# Altium project gumstix expansioan board.PrjPCB
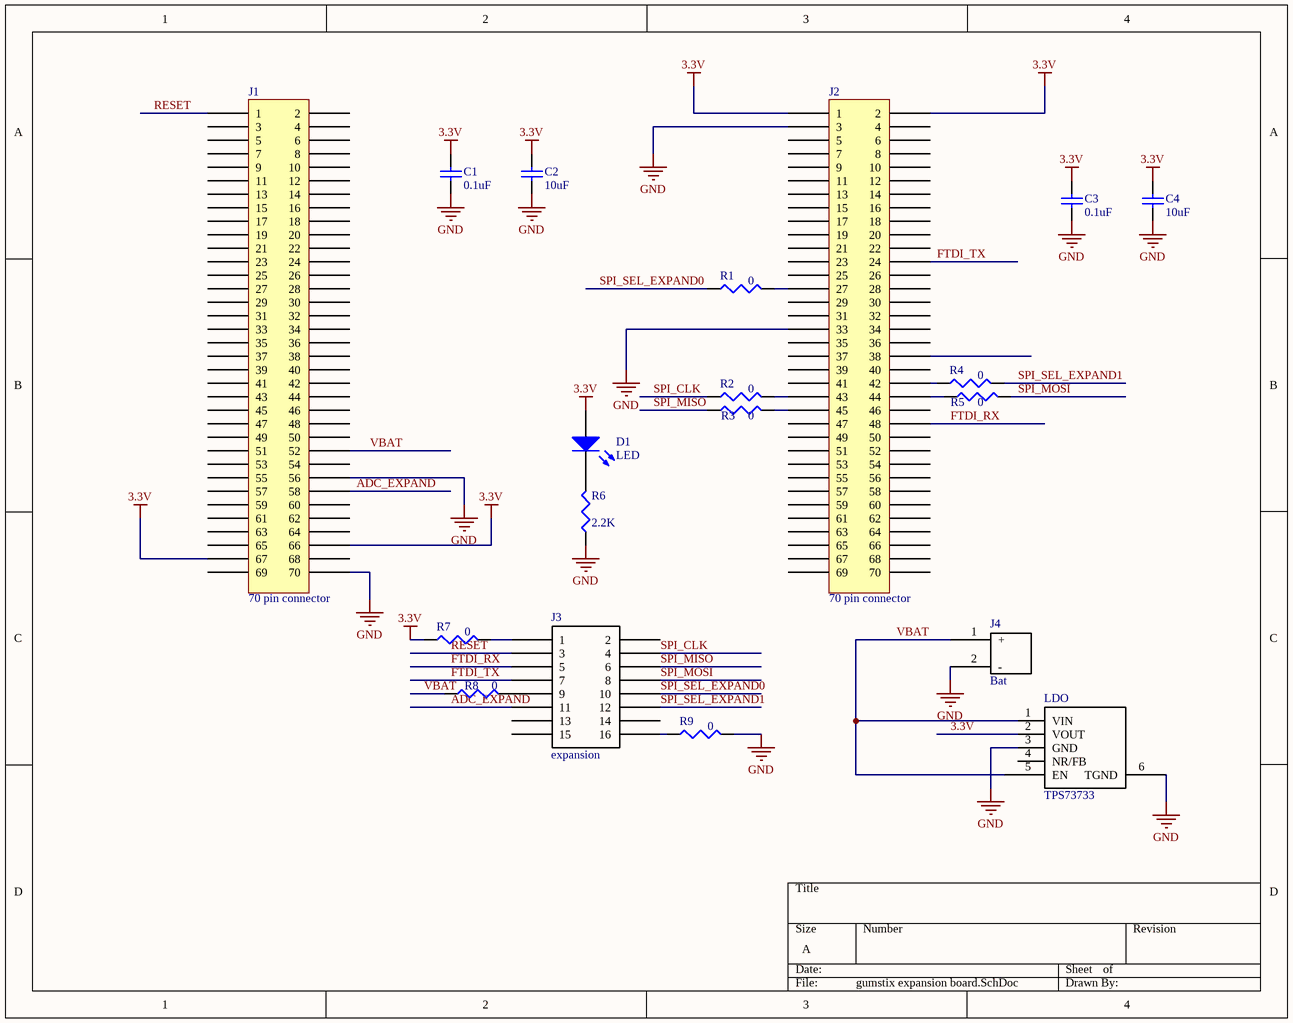
[diagram p0: gumstix expansion board.SchDoc]
1 sheet, 19 parts. Net scope: global (net labels, ports and power ports of the same name join across sheets).
Board file: gumstix expansion board.PcbDoc

## Sheet gumstix expansion board.SchDoc
size A

### Parts
C1  value 0.1uF  [CAPC1005L]
C2  value 10uF  [CAPC1608L]  (hidden comment: Cap Semi)
C3  value 0.1uF  [CAPC1005L]
C4  value 10uF  [CAPC1608L]  (hidden comment: Cap Semi)
D1  LED  [SurfaceMount(603)]
J1  70 pin connector  [AVX CONN_70]
J2  70 pin connector  [AVX CONN_70]
J3  expansion  [HEADERSM 8X2]
J4  Bat  [BatteryConnJST]
LDO  TPS73733  [SOT-223-5pin]
R1  value 0  [RESC1608L]  (hidden comment: Res3)
R2  value 0  [RESC1608L]  (hidden comment: Res3)
R3  value 0  [RESC1608L]  (hidden comment: Res3)
R4  value 0  [RESC1608L]  (hidden comment: Res3)
R5  value 0  [RESC1608L]  (hidden comment: Res3)
R6  value 2.2K  [RESC1608L]  (hidden comment: Res3)
R7  value 0  [RESC1608L]  (hidden comment: Res3)
R8  value 0  [RESC1608L]  (hidden comment: Res3)
R9  value 0  [RESC1608L]  (hidden comment: Res3)

### Nets
3.3V: C1.2 C2.2 C3.2 C4.2 D1.1(A) J1.66 J1.67 J2.1 J2.2 LDO.2(VOUT) R7.1
GND: C1.1 C2.1 C3.1 C4.1 J1.56 J1.70 J2.3 J2.33 J4.2(-) LDO.3(GND) LDO.6(TGND) R6.1 R9.2
ADC_EXPAND: J1.58 J3.11
FTDI_RX: J2.48 J3.5
FTDI_TX: J2.24 J3.7
RESET: J1.1 J3.3
SPI_CLK: J3.4 R2.1
SPI_MISO: J3.6 R3.1
SPI_MOSI: J3.8 R5.2
SPI_SEL_EXPAND0: J3.10 R1.1
SPI_SEL_EXPAND1: J3.12 R4.2
VBAT: J1.52 J4.1(+) LDO.1(VIN) LDO.5(EN) R8.1
NetD1_2: D1.2(K) R6.2
NetJ2_27: J2.27 R1.2
NetJ2_42: J2.42 R4.1
NetJ2_43: J2.43 R2.2
NetJ2_44: J2.44 R5.1
NetJ2_45: J2.45 R3.2
NetJ3_1: J3.1 R7.2
NetJ3_9: J3.9 R8.2
NetJ3_16: J3.16 R9.1

Not connected (* = marked no-connect by the designer): J1 2 3 4 5 6 7 8 9 10 11 12 13 14 15 16 17 18 19 20 21 22 23 24 25 26 27 28 29 30 31 32 33 34 35 36 37 38 39 40 41 42 43 44 45 46 47 48 49 50 51 53 54 55 57 59 60 61 62 63 64 65 68 69; J2 4 5 6 7 8 9 10 11 12 13 14 15 16 17 18 19 20 21 22 23 25 26 28 29 30 31 32 34 35 36 37 38 39 40 41 46 47 49 50 51 52 53 54 55 56 57 58 59 60 61 62 63 64 65 66 67 68 69 70; J3 2 13 14 15; LDO 4(NR/FB)

### Library data of the parts
C1 C3 = Cap: Capacitor; Published: 8-Jun-2000; LatestRevisionDate: 17-Jul-2002; LatestRevisionNote: Re-released for DXP Platform.; PackageReference: RAD-0.3; Publisher: Altium Limited
C2 C4 = Cap Semi: Capacitor (Semiconductor SIM Model); Published: 8-Jun-2000; LatestRevisionDate: 29-May-2009; LatestRevisionNote: IPC-7351 Footprint Added.; PackageReference: C1206; Publisher: Altium Limited; PackageDescription: Chip Capacitor
J1 J2 = 70 pin AVX connector
J3 = HEADER 8X2
J4 = BatteryConnJST
LDO = LDO33-TI-TPS73733
R1-R9 = Res3: Resistor; Published: 8-Jun-2000; LatestRevisionDate: 29-May-2009; LatestRevisionNote: IPC-7351 Footprint Added.; PackageReference: J1-0603; Publisher: Altium Limited; PackageDescription: Chip Resistor